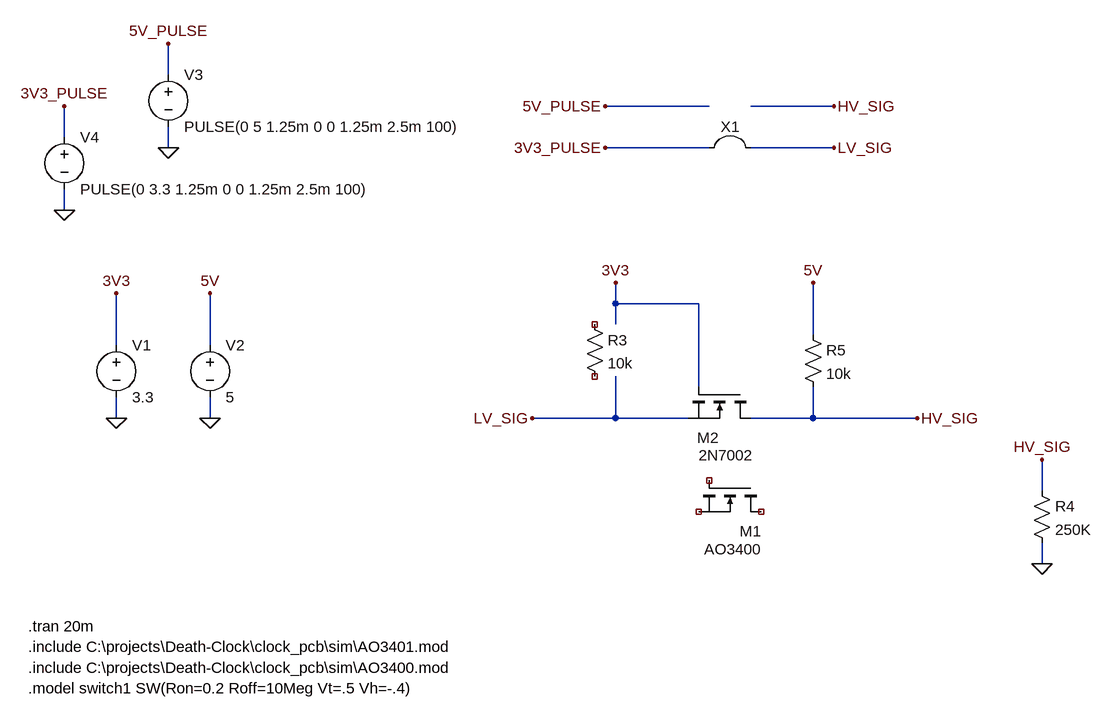
[diagram p0: schematic lvl_shifter.asc]
lvl_shifter.asc, the LTspice schematic file:
Version 4
SHEET 1 1272 908
WIRE -464 -272 -464 -320
WIRE 368 -224 208 -224
WIRE 560 -224 432 -224
WIRE -624 -176 -624 -224
WIRE -464 -160 -464 -192
WIRE 368 -160 208 -160
WIRE 560 -160 432 -160
WIRE -624 -64 -624 -96
WIRE 224 80 224 48
WIRE 352 80 224 80
WIRE 224 112 224 80
WIRE 528 128 528 48
WIRE -544 144 -544 64
WIRE -400 144 -400 64
WIRE 352 208 352 80
WIRE -544 256 -544 224
WIRE -400 256 -400 224
WIRE 224 256 224 192
WIRE 224 256 96 256
WIRE 336 256 224 256
WIRE 528 256 528 208
WIRE 528 256 432 256
WIRE 688 256 528 256
WIRE 880 368 880 320
WIRE 880 480 880 448
FLAG -544 64 3V3
FLAG -400 256 0
FLAG -400 64 5V
FLAG 880 480 0
FLAG -464 -320 5V_PULSE
FLAG -464 -160 0
FLAG -544 256 0
FLAG 528 48 5V
FLAG 224 48 3V3
FLAG 96 256 LV_SIG
FLAG 688 256 HV_SIG
FLAG 880 320 HV_SIG
FLAG -624 -224 3V3_PULSE
FLAG -624 -64 0
FLAG 208 -160 3V3_PULSE
FLAG 208 -224 5V_PULSE
FLAG 560 -224 HV_SIG
FLAG 560 -160 LV_SIG
SYMBOL voltage -544 128 R0
WINDOW 123 0 0 Left 0
WINDOW 39 0 0 Left 0
SYMATTR InstName V1
SYMATTR Value 3.3
SYMBOL voltage -400 128 R0
WINDOW 123 0 0 Left 0
WINDOW 39 0 0 Left 0
SYMATTR InstName V2
SYMATTR Value 5
SYMBOL res 864 352 R0
SYMATTR InstName R4
SYMATTR Value 250K
SYMBOL nmos 448 352 R90
WINDOW 0 78 -1 VRight 2
WINDOW 3 79 56 Invisible 2
WINDOW 38 106 -1 VRight 2
SYMATTR InstName M1
SYMATTR Value ""
SYMATTR SpiceModel AO3400
SYMATTR Prefix X
SYMBOL res 176 96 R0
SYMATTR InstName R3
SYMATTR Value 10k
SYMBOL res 512 112 R0
SYMATTR InstName R5
SYMATTR Value 10k
SYMBOL voltage -624 -192 R0
WINDOW 123 0 0 Left 0
WINDOW 39 0 0 Left 0
SYMATTR InstName V4
SYMATTR Value PULSE(0 3.3 1.25m 0 0 1.25m 2.5m 100)
SYMBOL Misc\\jumper 400 -224 R0
SYMATTR InstName X1
SYMBOL voltage -464 -288 R0
WINDOW 123 0 0 Left 0
WINDOW 39 0 0 Left 0
SYMATTR InstName V3
SYMATTR Value PULSE(0 5 1.25m 0 0 1.25m 2.5m 100)
SYMBOL nmos 432 208 R90
WINDOW 0 78 49 VRight 2
WINDOW 3 105 -5 VRight 2
SYMATTR InstName M2
SYMATTR Value 2N7002
TEXT -680 576 Left 2 !.tran 20m
TEXT -680 672 Left 2 !.model switch1 SW(Ron=0.2 Roff=10Meg Vt=.5 Vh=-.4)
TEXT -680 608 Left 2 !.include C:\\projects\\Death-Clock\\clock_pcb\\sim\\AO3401.mod
TEXT -680 640 Left 2 !.include C:\\projects\\Death-Clock\\clock_pcb\\sim\\AO3400.mod

The netlist it stands for:
* lvl_shifter.asc
V1 3V3 0 3.3
V2 5V 0 5
R4 HV_SIG 0 250K
XM1 NC_01 NC_02 NC_03 AO3400  ; pins D G S
R3 NC_04 NC_05 10k
R5 5V HV_SIG 10k
V4 3V3_PULSE 0 PULSE(0 3.3 1.25m 0 0 1.25m 2.5m 100)
V3 5V_PULSE 0 PULSE(0 5 1.25m 0 0 1.25m 2.5m 100)
M2 HV_SIG 3V3 3V3_PULSE 3V3_PULSE 2N7002
.model NMOS NMOS
.model PMOS PMOS
.lib standard.mos
.tran 20m
.model switch1 SW(Ron=0.2 Roff=10Meg Vt=.5 Vh=-.4)
.include C:\projects\Death-Clock\clock_pcb\sim\AO3401.mod
.include C:\projects\Death-Clock\clock_pcb\sim\AO3400.mod
.backanno
.end